# Altium project Radar_Connector.PrjPcb
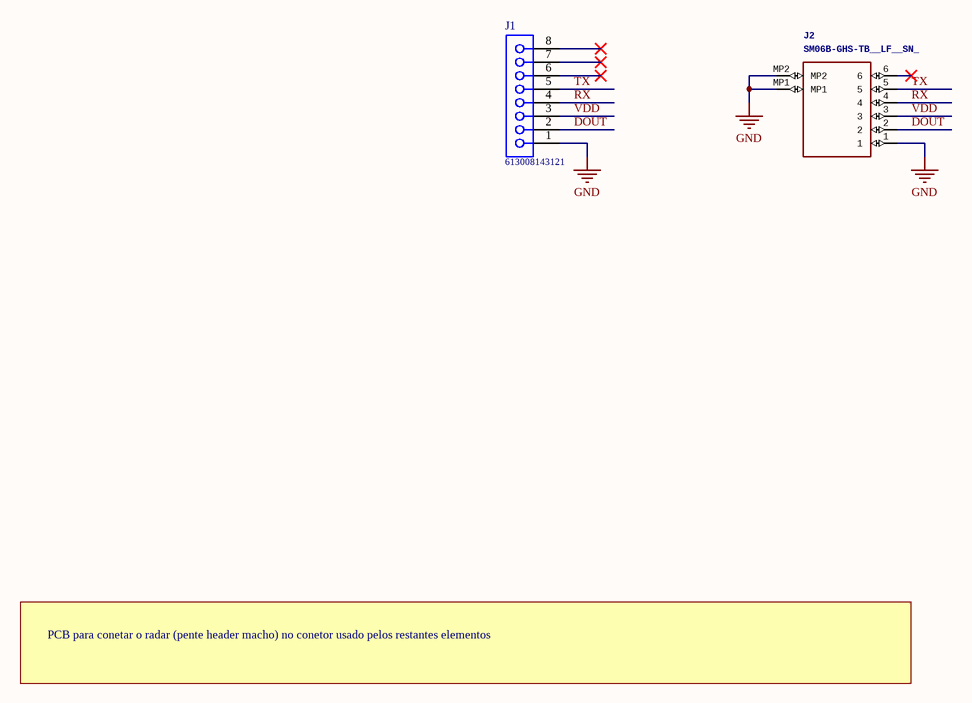
[diagram p0: Radar_Connector.SchDoc]
1 sheet, 2 parts. Net scope: global (net labels, ports and power ports of the same name join across sheets).
Board file: Radar_Connector.PcbDoc

## Sheet Radar_Connector.SchDoc: Radar Connector
size A4; DrawnBy: Flávio Silva; Engineer: Flávio Silva; Organization: CeNTI; Address1: Rua Fernando Mesquita 2785; Address2: Vila Nova de Famalicão; Address3: 4760-034, Portugal; Revision: 0; SheetNumber: 1; SheetTotal: 1; Project: AM2R- Safe2Wheels

### Parts
J1  613008143121  [613008143121]
J2  SM06B-GHS-TB__LF__SN_  [SM06BGHSTBLFSN]

### Nets
GND: J1.1 J2.1 J2.MP1 J2.MP2
DOUT: J1.2 J2.2
RX: J1.4 J2.4
TX: J1.5 J2.5
VDD: J1.3 J2.3

Not connected (* = marked no-connect by the designer): J1 6* 7* 8*; J2 6*

### Notes on the sheet
- PCB para conetar o radar (pente header macho) no conetor usado pelos restantes elementos
- Title:
- Project:
- Date:
- Rev:
- Sheet
- of
- Author:

### Library data of the parts
J1 = 613008143121: WR-PHD Socket Header, THT, pitch 2.54mm, Single Row, Angled, 8pin; Pin Number: 8; Gender: Female; Rated Current: 3A; Working Voltage: 250VAC; Withstanding Voltage: 500VAC; Contact Resistance: 20mOhm; ComponentLink1Description: Manufacturer; ComponentLink1URL: http://www.we-online.de; ComponentLink2Description: Datasheet; ComponentLink2URL: https://katalog.we-online.de/em/datasheet/6130xx143121.pdf; Part Number: 613008143121; Published Date: June 2019; Publisher: Wurth Elektronik; Pitch: 2.54mm; Operating Temperature: -40 to +125degC; Mounting Technology: THT; Packaging: Tray; Row Number: Single; Orientation: Angled
J2 = SM06B-GHS-TB__LF__SN_: Conn Shrouded Header HDR 6 POS 1.25mm Solder RA Side Entry SMD T/R   Source:  Datasheet; Manufacturer_Name: JST (JAPAN SOLDERLESS TERMINALS); Manufacturer_Part_Number: SM06B-GHS-TB (LF)(SN); GateName_1: G$1; SymbolName_1: SM06B-GHS-TB__LF__SN_; LibraryName: SM06B-GHS-TB__LF__SN_; DeviceSetName: SM06B-GHS-TB__LF__SN_; Arrow_Part_Number: SM06B-GHS-TB (LF)(SN); Arrow_Price-Stock: https://www.arrow.com/en/products/sm06b-ghs-tb-lf-sn/jst-manufacturing; Height: 4.25mm